# Altium schematic sheet AccumulatorFanController.SchDoc
size A4
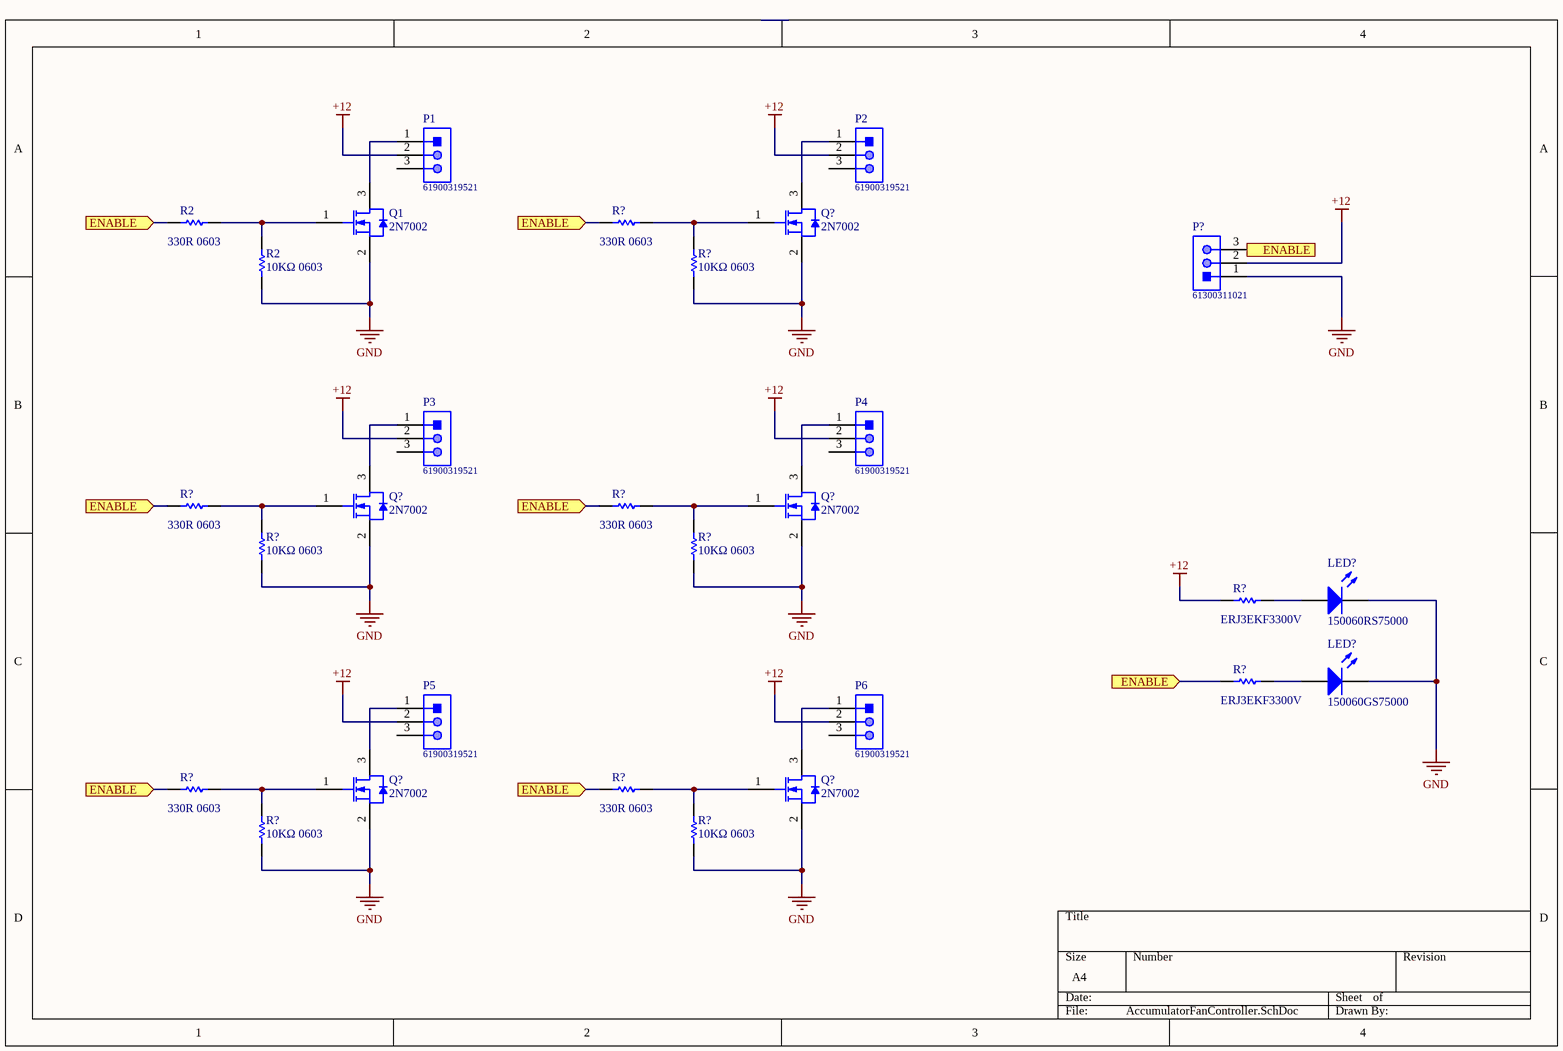
[diagram p0: AccumulatorFanController.SchDoc]

## Parts
(Parts that share a designator on the sheet are numbered #1, #2 ... from top to bottom, then left to right.)
LED?#1  150060RS75000  [0603_A]
LED?#2  150060GS75000  [0603_A]
P1  61900319521  [61900319521]
P2  61900319521  [61900319521]
P3  61900319521  [61900319521]
P4  61900319521  [61900319521]
P5  61900319521  [61900319521]
P6  61900319521  [61900319521]
P?  61300311021  [61300311021]
Q1  2N7002  [STM-SOT-23-3_V]
Q?#1  2N7002  [STM-SOT-23-3_V]
Q?#2  2N7002  [STM-SOT-23-3_V]
Q?#3  2N7002  [STM-SOT-23-3_V]
Q?#4  2N7002  [STM-SOT-23-3_V]
Q?#5  2N7002  [STM-SOT-23-3_V]
R2#1  330R 0603  [RESC1608X55X30NL15T15]
R2#2  10KΩ 0603  [RESC1608X55X30NL15T15]
R?#1  330R 0603  [RESC1608X55X30NL15T15]
R?#2  10KΩ 0603  [RESC1608X55X30NL15T15]
R?#3  330R 0603  [RESC1608X55X30NL15T15]
R?#4  330R 0603  [RESC1608X55X30NL15T15]
R?#5  10KΩ 0603  [RESC1608X55X30NL15T15]
R?#6  10KΩ 0603  [RESC1608X55X30NL15T15]
R?#7  ERJ3EKF3300V  [RESC1608X55X30NL15T15]
R?#8  ERJ3EKF3300V  [RESC1608X55X30NL15T15]
R?#9  330R 0603  [RESC1608X55X30NL15T15]
R?#10  330R 0603  [RESC1608X55X30NL15T15]
R?#11  10KΩ 0603  [RESC1608X55X30NL15T15]
R?#12  10KΩ 0603  [RESC1608X55X30NL15T15]

## Ports
ENABLE (in)

## Nets
+12: P1.2 P2.2 P3.2 P4.2 P5.2 P6.2 P?.2 R?#7.1
GND: LED?#1.1(K) LED?#2.1(K) P?.1 Q1.2(S) Q?#1.2(S) Q?#2.2(S) Q?#3.2(S) Q?#4.2(S) Q?#5.2(S) R2#2.1 R?#2.1 R?#5.1 R?#6.1 R?#11.1 R?#12.1
ENABLE: P?.3 R2#1.1 R?#1.1 R?#3.1 R?#4.1 R?#8.1 R?#9.1 R?#10.1 ; port ENABLE
NetLED?#1_2: LED?#1.2(A) R?#7.2
NetLED?#2_2: LED?#2.2(A) R?#8.2
NetP1_1: P1.1 Q1.3(D)
NetP2_1: P2.1 Q?#1.3(D)
NetP3_1: P3.1 Q?#2.3(D)
NetP4_1: P4.1 Q?#3.3(D)
NetP5_1: P5.1 Q?#4.3(D)
NetP6_1: P6.1 Q?#5.3(D)
NetQ1_1: Q1.1(G) R2#1.2 R2#2.2
NetQ?#1_1: Q?#1.1(G) R?#1.2 R?#2.2
NetQ?#2_1: Q?#2.1(G) R?#3.2 R?#5.2
NetQ?#3_1: Q?#3.1(G) R?#4.2 R?#6.2
NetQ?#4_1: Q?#4.1(G) R?#9.2 R?#11.2
NetQ?#5_1: Q?#5.1(G) R?#10.2 R?#12.2

Not connected (* = marked no-connect by the designer): P1 3; P2 3; P3 3; P4 3; P5 3; P6 3

## Library data of the parts
LED?#1 = CMP-1426-00001-1: SMD mono-color Chip LED, WL-SMCW, Red; Manufacturer: Wuerth Elektronik; Color: Red; PackageReference: 0603_A; ComponentLink2URL: http://katalog.we-online.com/led/datasheet/150060RS75000.pdf; ComponentLink1URL: http://www.we-online.com; ComponentLink1Description: Manufacturer URL; ComponentLink2Description: Datasheet; PartNumber: 150060RS75000
LED?#2 = CMP-1426-00002-1: SMD mono-color Chip LED, WL-SMCW, Green; Manufacturer: Wuerth Elektronik; ComponentLink1URL: http://www.we-online.com; ComponentLink2Description: Datasheet; Color: Green; ComponentLink2URL: http://katalog.we-online.com/led/datasheet/150060GS75000.pdf; PartNumber: 150060GS75000; PackageReference: 0603_A; ComponentLink1Description: Manufacturer URL
P1-P6 = CMP-1502-00600-1: Male Top Locking Header WR-WTB, THT, Right Angled, pitch 2.54 mm, 1 x 3 position; Manufacturer: Wurth Elektronik; Working Voltage: 250VAC; Pitch: 2.54mm; Position: 1x3; Contact Resistance: 20mOhm; Package Reference: 61900319521; Manufacturer URL: http://www.we-online.de; Orientation: RightAngled; Operating Temperature: -40to105degC; Publisher: WurthElektronik; Packaging: Bag; Datasheet URL: https://katalog.we-online.de/em/datasheet/6190xx19521.pdf; Gender: Male; Mounting Technology: THT; Part Number: 61900319521
P? = CMP-1502-01061-1: THT Angled Pin Header WR-PHD, Pitch 2.54 mm, Single Row, 3 pins; Manufacturer: Wurth Elektronik; Pitch: 2.54mm; Contact Resistance: 20mOhm; Gender: Male; Pin Number: 3; Rated Current: 3A; Working Voltage: 250VAC; Withstanding Voltage: 500VAC; Package Reference: 61300311021; Manufacturer URL: http://www.we-online.de; Datasheet URL: https://katalog.we-online.de/em/datasheet/6130xx11021.pdf; Row Number: Single; Operating Temperature: -40to105degC; Publisher: WurthElektronik; Orientation: Angled; Mounting Technology: THT; Part Number: 61300311021; Packaging: Bag
Q1 Q?#1-Q?#5 = CMP-0434-00001-1: N-channel 60 V, 1.8 Ohm, 0.35 A STripFET(TM) II Power MOSFET, SOT23; Manufacturer: STMicroelectronics; PartNumber: 2N7002; ComponentLink2Description: Datasheet; ComponentLink2URL: http://www.st.com/st-web-ui/static/active/en/resource/technical/document/datasheet/CD00005134.pdf; ComponentLink1Description: Manufacturer URL; ComponentLink1URL: http://www.st.com/; DatasheetVersion: Rev. 9, 11/2008; PackageReference: SOT-23; Mounting Technology: Surface Mount; PackageDescription: 3-Pin SOT23, 3.016 x 2.8 mm Body, 0.95 mm Pitch
R2#1 R?#1 R?#3 R?#4 R?#9 R?#10 = CMP-2000-00435-1: Part Number: 0603WAJ0331T5E; Manufacturer: LCSC; Parameter 1: *
R2#2 R?#2 R?#5 R?#6 R?#11 R?#12 = CMP-2000-00435-1: Part Number: 0603WAJ0103T5E; Manufacturer: LCSC
R?#7 R?#8 = CMP-2000-00435-1: Manufacturer: Panasonic; Part Number: ERJ3EKF3300V